# Altium schematic sheet FLASH.SchDoc
size A; SheetNumber: 4; SheetTotal: 9
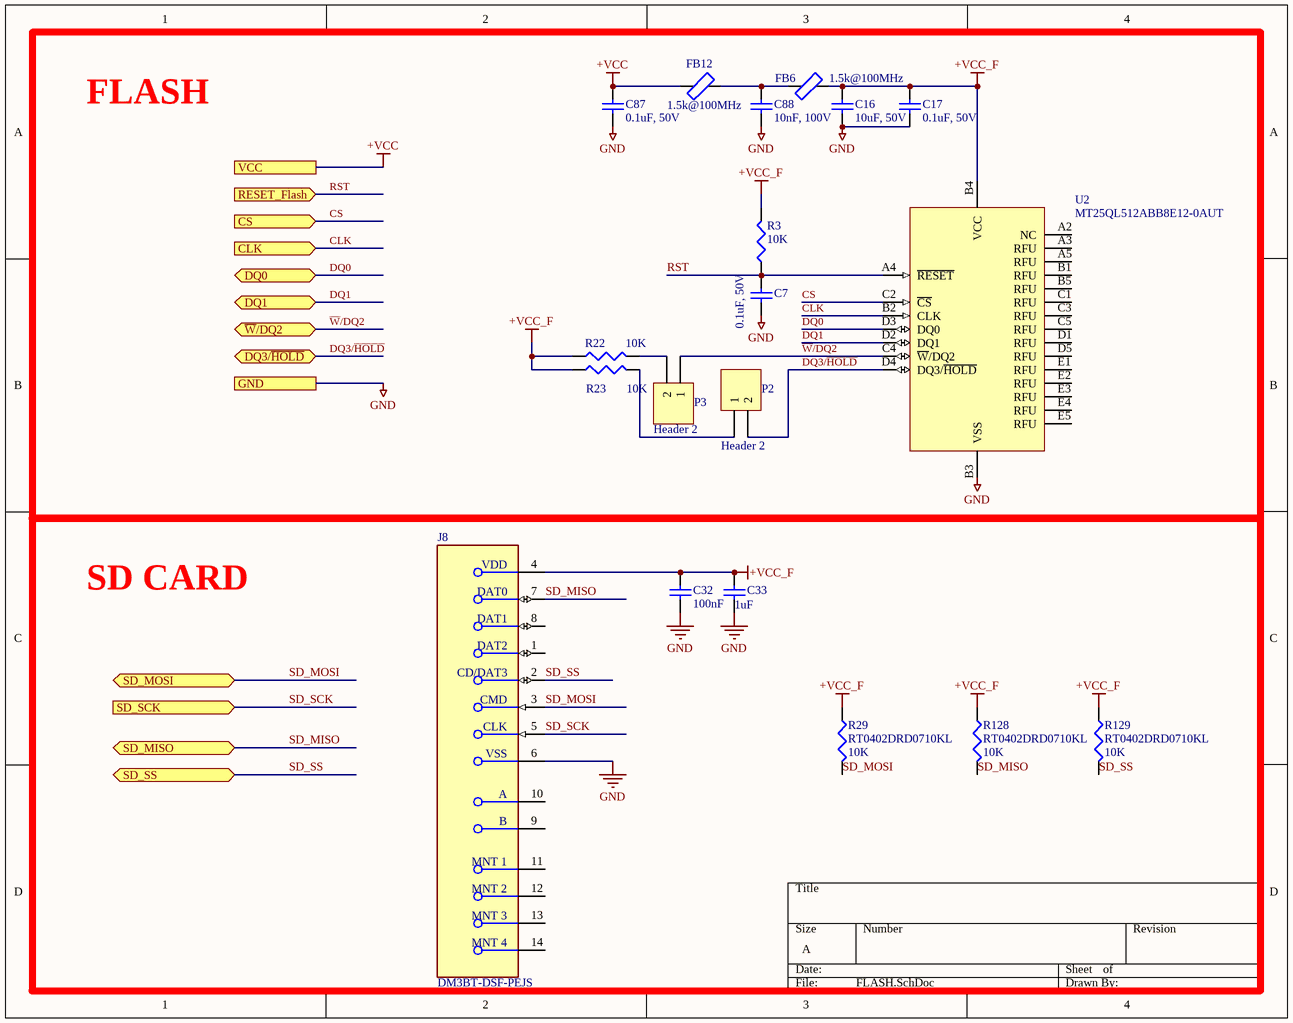
[diagram p0: FLASH.SchDoc]

## Parts
C7  0.1uF, 50V  [0805]
C16  10uF, 50V  [1206]
C17  0.1uF, 50V  [0805]
C32  100nF  [CAPC1005X55X30LL05T10]
C33  value 1uF  [C1206]  (hidden comment: C1206C105K4RACTU)
C87  0.1uF, 50V  [0805]
C88  10nF, 100V  [0603]
FB6  1.5k@100MHz  [0805]
FB12  1.5k@100MHz  [0805]
J8  DM3BT-DSF-PEJS  [FP-DM3BT-DSF-PEJS-MFG]
P2  Header 2  [HDR1X2]
P3  Header 2  [HDR1X2]
R3  value 10K  [0603]  (hidden comment: RT0603DRD0710KL)
R22  value 10K  [J1-0603]  (hidden comment: RT0603DRD0710KL)
R23  value 10K  [J1-0603]  (hidden comment: RT0603DRD0710KL)
R29  RT0402DRD0710KL  value 10K  [0402]
R128  RT0402DRD0710KL  value 10K  [0402]
R129  RT0402DRD0710KL  value 10K  [0402]
U2  MT25QL512ABB8E12-0AUT  [BGA24C100P5X5_600X800X120]

## Blocks framed on the sheet
FLASH: C7 C16 C17 C87 C88 FB6 FB12 P2 P3 R3 R22 R23 U2
SD CARD: C32 C33 J8 R29 R128 R129

## Ports
CLK (in), CS (in), DQ0 (bidir), DQ1 (bidir), DQ3/~{HOLD} (bidir), GND, RESET_Flash (in), SD_MISO (bidir), SD_MOSI (bidir), SD_SCK (in), SD_SS (bidir), VCC, ~{W}/DQ2 (bidir)

## Nets
+VCC: C87.2 FB12.2 ; port VCC
+VCC_F: C16.2 C17.2 C32.2 C33.2 FB6.2 J8.4(VDD) R3.2 R22.1 R23.1 R29.1 R128.1 R129.1 U2.B4(VCC)
GND: C7.1 C16.1 C17.1 C32.1 C33.1 C87.1 C88.2 J8.6(VSS) U2.B3(VSS) ; port GND
CLK: U2.B2(CLK) ; port CLK
CS: U2.C2(~{CS}) ; port CS
DQ0: U2.D3(DQ0) ; port DQ0
DQ1: U2.D2(DQ1) ; port DQ1
DQ3/~{HOLD}: P2.2 U2.D4(DQ3/~{HOLD}) ; port DQ3/~{HOLD}
RST: C7.2 R3.1 U2.A4(~{RESET}) ; port RESET_Flash
SD_MISO: J8.7(DAT0) R128.2 ; port SD_MISO
SD_MOSI: J8.3(CMD) R29.2 ; port SD_MOSI
SD_SCK: J8.5(CLK) ; port SD_SCK
SD_SS: J8.2(CD/DAT3) R129.2 ; port SD_SS
~{W}/DQ2: P3.1 U2.C4(~{W}/DQ2) ; port ~{W}/DQ2
NetC88_1: C88.1 FB6.1 FB12.1
NetP2_1: P2.1 R23.2
NetP3_2: P3.2 R22.2

Not connected (* = marked no-connect by the designer): J8 1(DAT2) 8(DAT1) 9(B) 10(A) 11(MNT_1) 12(MNT_2) 13(MNT_3) 14(MNT_4); U2 A2(NC) A3(RFU) A5(RFU) B1(RFU) B5(RFU) C1(RFU) C3(RFU) C5(RFU) D1(RFU) D5(RFU) E1(RFU) E2(RFU) E3(RFU) E4(RFU) E5(RFU)

## Library data of the parts
C7 C17 C87 = NS00353: 0.10µF ±10% 50V Ceramic Capacitor X7R 0805 (2012 Metric); Type: C; Alternatives: Generic; Part Number: NS00353; Value: 0.1uF, 50V; Supplier 1: Digi-Key; Supplier Part Number 1: 478-1395-1-ND
C16 = NS00832: CAP CER 10UF 50V X7R 1206; Type: C; Alternatives: Generic; Part Number: NS00832; Value: 10uF, 50V; Supplier 1: Digi-Key; Supplier Part Number 1: 1276-6767-1-ND
C32 = CMP-0001-00074-2: Suuplier 1: Digi-Key; Supplier Part Number 1: 399-C0402C104K4RAC7867TR-ND
C33 = Cap Semi: Capacitor (Semiconductor SIM Model); Published: 8-Jun-2000; LatestRevisionDate: 29-May-2009; LatestRevisionNote: IPC-7351 Footprint Added.; PackageReference: C1206; Publisher: Altium Limited; PackageDescription: Chip Capacitor; Supplier 1: Digi-Key; Supplier Part Number 1: 399-C1206C105K4RAC7800TR-ND
C88 = NS00848: CAP CER 10000PF 100V C0G 0603; Type: C; Alternatives: Generic; Part Number: NS00848; Value: 10nF, 100V; Supplier 1: Digi-Key; Supplier Part Number 1: 445-172665-1-ND
FB6 FB12 = NS00881: WE-CBA SMT EMI SUPPRESSION FERRITE; Type: Inductor; Part Number: NS00881; Value: 1.5k@100MHz; ComponentLink1Description: Datasheet; ComponentLink1URL: H:\Doc\Wurth\782853162.pdf; Supplier 1: Digi-Key; Supplier Part Number 1: 732-782853162CT-ND
J8 = CMP-11597-000004-1: CONN MICRO SD CARD PUSH-PUSH R/A; Connector Type: Connector; Pitch: 1.1mm; Insulation Resistance: 1GR; Contact Resistance: 100mR; Number of Positions: 8; Max Voltage Rating (AC): 125V; Gender: Female; Current Rating: 500mA; Flammability Rating: UL94 V-0; Min Operating Temperature: -25°C; Lead Free: Lead Free; Length: 13.85mm; Radiation Hardening: No; Orientation: Right Angle; Mount: Surface Mount; Housing Material: Polymer; Contact Material: Copper Alloy; Package Quantity: 1; Contact Plating: Gold; Termination: Solder; Max Operating Temperature: 85°C; Number of Contacts: 8; Voltage Rating (AC): 125V; REACH SVHC: No SVHC; Depth: 1.83mm; Max Current Rating: 500mA; Width: 16.05mm; Number of Rows: 1; Packaging: Tape and Reel; Supplier 1: Digi-Key; Supplier Part Number 1: HR1942TR-ND
P2 P3 = Header 2: Header, 2-Pin; LatestRevisionDate: 17-Jul-2002; LatestRevisionNote: Re-released for DXP Platform.; Publisher: Altium Limited
R3 R22 R23 R29 R128 R129 = Res3: Resistor; Published: 8-Jun-2000; LatestRevisionDate: 29-May-2009; LatestRevisionNote: IPC-7351 Footprint Added.; PackageReference: J1-0603; Publisher: Altium Limited; PackageDescription: Chip Resistor; Supplier 1: Digi-Key
  R3 R22 R23: Supplier Part Number 1: 311-10KDTR-ND
  R29 R128 R129: Supplier Part Number 1: 311-2131-2-ND
U2 = NS00922: IC FLASH 512MBIT SPI 24TPBGA; Part Number: NS00922; Type: IC; Value: MT25QL512ABB8E12-0AUT; ComponentLink1Description: Datasheet; ComponentLink1URL: H:\Doc\Micron\mt25q_qlkt_l_512_abb_0.pdf; Supplier 1: Digi-Key; Supplier Part Number 1: MT25QL512ABB8E12-0AUT-ND